# Altium schematic sheet Interface.SchDoc
size A4
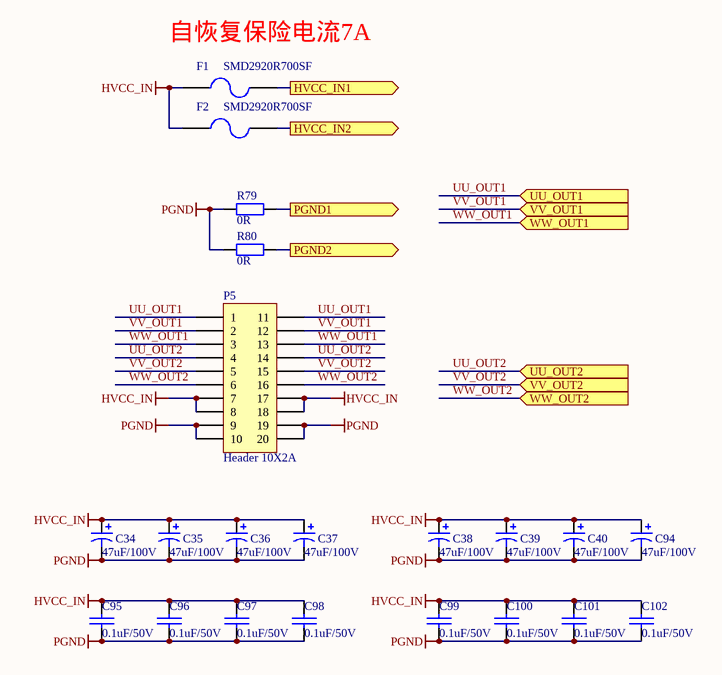
[diagram p0: Interface.SchDoc]

## Parts
C34  47uF/100V  [WP_1210CC]
C35  47uF/100V  [WP_1210CC]
C36  47uF/100V  [WP_1210CC]
C37  47uF/100V  [WP_1210CC]
C38  47uF/100V  [WP_1210CC]
C39  47uF/100V  [WP_1210CC]
C40  47uF/100V  [WP_1210CC]
C94  47uF/100V  [WP_1210CC]
C95  0.1uF/50V  [WP_0805C]
C96  0.1uF/50V  [WP_0805C]
C97  0.1uF/50V  [WP_0805C]
C98  0.1uF/50V  [WP_0805C]
C99  0.1uF/50V  [WP_0805C]
C100  0.1uF/50V  [WP_0805C]
C101  0.1uF/50V  [WP_0805C]
C102  0.1uF/50V  [WP_0805C]
F1  SMD2920R700SF  [WP_2420]
F2  SMD2920R700SF  [WP_2420]
P5  Header 10X2A  [WP_CRM222-020]
R79  0R  [WP_JS2L]
R80  0R  [WP_JS2L]

## Ports
HVCC_IN1 (out), HVCC_IN2 (out), PGND1 (out), PGND2 (out), UU_OUT1 (in), UU_OUT2 (in), VV_OUT1 (in), VV_OUT2 (in), WW_OUT1 (in), WW_OUT2 (in)

## Nets
HVCC_IN: C34.1 C35.1 C36.1 C37.1 C38.1 C39.1 C40.1 C94.1 C95.1 C96.1 C97.1 C98.1 C99.1 C100.1 C101.1 C102.1 F1.1 F2.1 P5.7 P5.8 P5.17 P5.18
PGND: C34.2 C35.2 C36.2 C37.2 C38.2 C39.2 C40.2 C94.2 C95.2 C96.2 C97.2 C98.2 C99.2 C100.2 C101.2 C102.2 P5.9 P5.10 P5.19 P5.20 R79.1 R80.1
HVCC_IN1: F1.2 ; port HVCC_IN1
HVCC_IN2: F2.2 ; port HVCC_IN2
PGND1: R79.2 ; port PGND1
PGND2: R80.2 ; port PGND2
UU_OUT1: P5.1 P5.11 ; port UU_OUT1
UU_OUT2: P5.4 P5.14 ; port UU_OUT2
VV_OUT1: P5.2 P5.12 ; port VV_OUT1
VV_OUT2: P5.5 P5.15 ; port VV_OUT2
WW_OUT1: P5.3 P5.13 ; port WW_OUT1
WW_OUT2: P5.6 P5.16 ; port WW_OUT2

## Notes on the sheet
- Labels drawn without touching a wire or pin: 自恢复保险电流7A

## Library data of the parts
C34-C40 C94 = Cap Pol1: Polarized Capacitor (Radial); Value: 220uF/250V; Published: 8-Jun-2000; LatestRevisionDate: 17-Jul-2002; LatestRevisionNote: Re-released for DXP Platform.; PackageReference: RB7.6-15; Publisher: Altium Limited; PackageDescription: Polarized Capacitor (Radial); 2 Leads
C95-C102 = CAP: Capacitor
F1 F2 = Fuse 2: Fuse; Published: 8-Jun-2000; LatestRevisionDate: 17-Jul-2002; LatestRevisionNote: Re-released for DXP Platform.; PackageReference: PIN-W2/E2.8; Publisher: Altium Limited; PackageDescription: Thru-Hole; 2 Leads
P5 = Header 10X2A: Header, 10-Pin, Dual row; LatestRevisionDate: 17-Jul-2002; LatestRevisionNote: Re-released for DXP Platform.; Publisher: Altium Limited
R79 R80 = Res2: Resistor; Published: 8-Jun-2000; Revision: July-2002: Re-released for DXP Platform.; Publisher: Altium Limited